# EAGLE design GameboyCartridgeKS_RevengeLite (EAGLE 9.5.2)
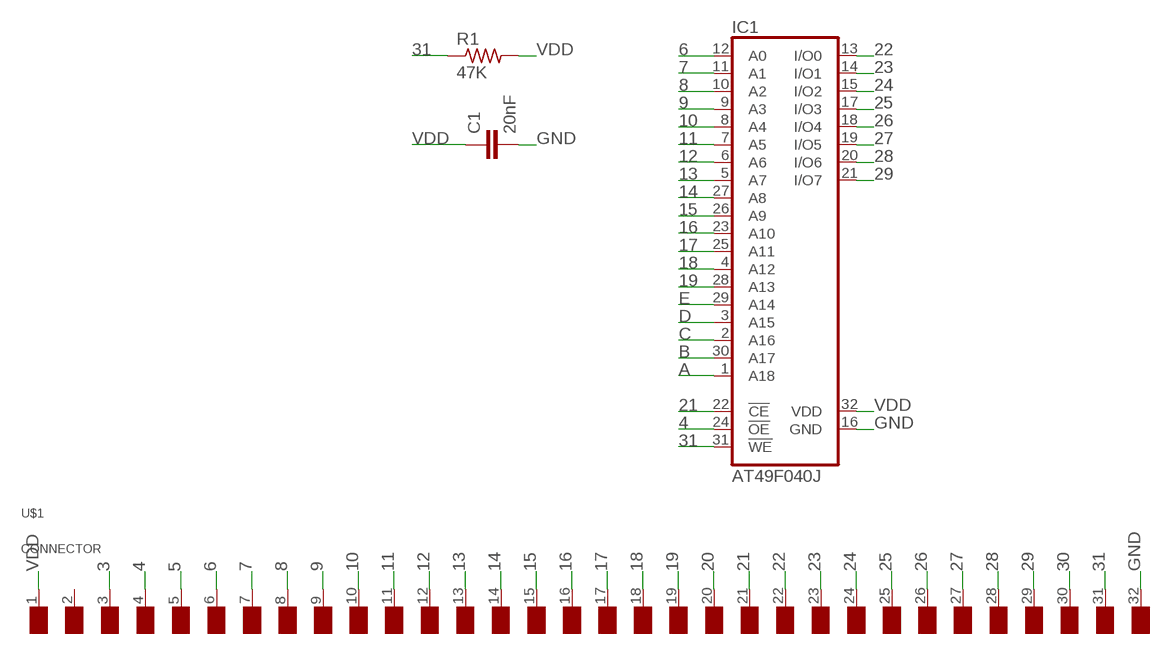
[diagram p0: schematic, sheet 1]

## Parts
C1  20nF  C-EUC0805  [C0805]
IC1  AT49F040J  [PLCC32R]
R1  47K  R-US_M0805  [M0805]
U$1  CONNECTOR  [CONNECTOR]

## Nets
3: U$1.3(/WR)
4: IC1.24(!OE) U$1.4(/RD)
5: U$1.5(/RCS)
6: IC1.12(A0) U$1.6(A0)
7: IC1.11(A1) U$1.7(A1)
8: IC1.10(A2) U$1.8(A2)
9: IC1.9(A3) U$1.9(A3)
10: IC1.8(A4) U$1.10(A4)
11: IC1.7(A5) U$1.11(A5)
12: IC1.6(A6) U$1.12(A6)
13: IC1.5(A7) U$1.13(A7)
14: IC1.27(A8) U$1.14(A8)
15: IC1.26(A9) U$1.15(A9)
16: IC1.23(A10) U$1.16(A10)
17: IC1.25(A11) U$1.17(A11)
18: IC1.4(A12) U$1.18(A12)
19: IC1.28(A13) U$1.19(A13)
20: U$1.20(A14)
21: IC1.22(!CE) U$1.21(A15)
22: IC1.13(I/O0) U$1.22(D0)
23: IC1.14(I/O1) U$1.23(D1)
24: IC1.15(I/O2) U$1.24(D2)
25: IC1.17(I/O3) U$1.25(D3)
26: IC1.18(I/O4) U$1.26(D4)
27: IC1.19(I/O5) U$1.27(D5)
28: IC1.20(I/O6) U$1.28(D6)
29: IC1.21(I/O7) U$1.29(D7)
30: U$1.30(/RS)
31: IC1.31(!WE) R1.1 U$1.31(VIN)
A: IC1.1(A18)
B: IC1.30(A17)
C: IC1.2(A16)
D: IC1.3(A15)
E: IC1.29(A14)
GND: C1.2 IC1.16(GND) U$1.32(GND)
VDD: C1.1 IC1.32(VDD) R1.2 U$1.1(VDD)
Unconnected: U$1.2(NC)

## Library data of the parts
C1 = resistor:C-EU: CAPACITOR, European symbol
IC1 = gameboy:AT49F040J: 4-Megabit FLASH MEMORY (512 K x 8 bit) 5 V-only
R1 = resistor:R-US_: RESISTOR, American symbol
U$1 = gameboy:CONNECTOR: Connector Pads for Gameboy Cartridges

## Board
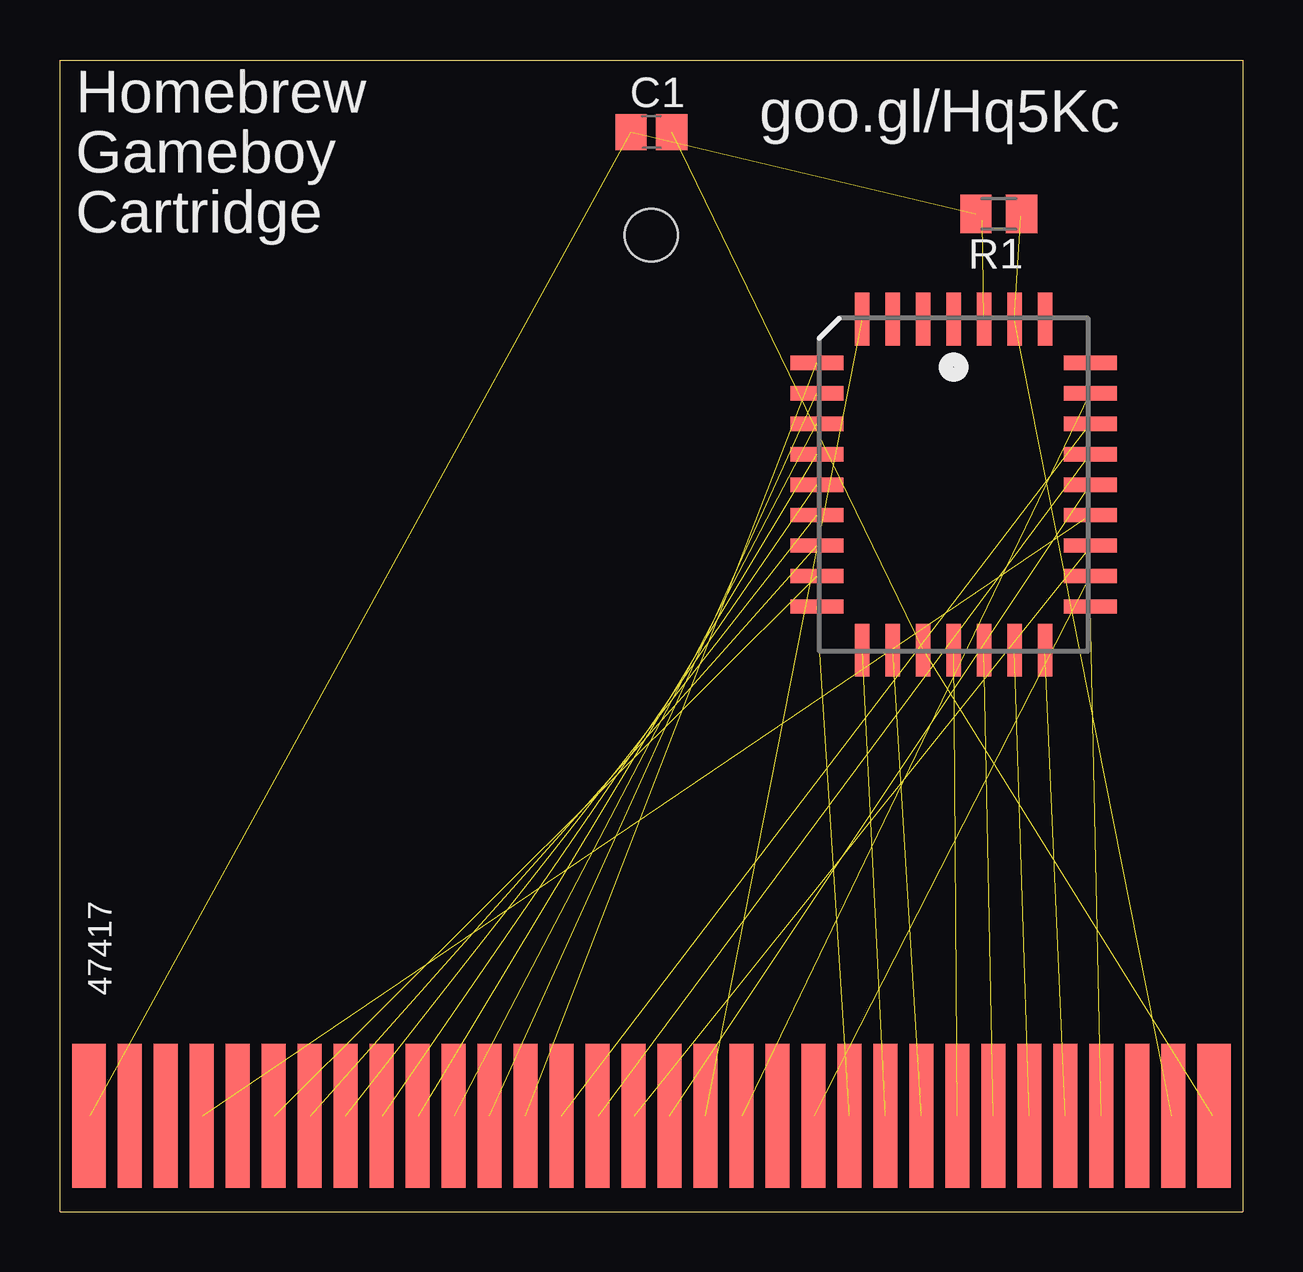
[diagram p1: board, top side]

Size 49.3 x 48 mm. Coordinates in mm from the lower left corner, seen from the top.
Outline: 49.3,48 49.3,0 0,0 0,48 49.3,48
Copper layers (1*16): Top 0.035mm / dielectric 1.5mm / Bottom 0.035mm
Design rules "default": minimum track width 6mil, minimum drill 12mil, track to track 6mil, track to pad 6mil, pad to pad 6mil, via to via 6mil, smd to smd 0mil, copper to edge 10mil, drill to drill 10mil, minimum pad ring 10mil, minimum via ring 6mil, stop-mask expansion 2mil, vias tented up to drill 100mil, thermal gap 10mil
Holes 2.2 mm at 24.65,40.7

### Footprints (pad centres in the part's own frame; a part is rotated, then mirrored left to right if it is on the bottom)
C0805 = smd 1.3 x 1.5: 1 -0.85,0; 2 0.85,0
PLCC32R = smd 0.6 x 2.2: 1 0,6.9; 2 -1.27,6.9; 3 -2.54,6.9; 4 -3.81,6.9; 14 -3.81,-6.9; 15 -2.54,-6.9; 16 -1.27,-6.9; 17 0,-6.9; 18 1.27,-6.9; 19 2.54,-6.9; 20 3.81,-6.9; 30 3.81,6.9; 31 2.54,6.9; 32 1.27,6.9 | smd 2.2 x 0.6: 5 -5.7,5.08; 6 -5.7,3.81; 7 -5.7,2.54; 8 -5.7,1.27; 9 -5.7,0; 10 -5.7,-1.27; 11 -5.7,-2.54; 12 -5.7,-3.81; 13 -5.7,-5.08; 21 5.7,-5.08; 22 5.7,-3.81; 23 5.7,-2.54; 24 5.7,-1.27; 25 5.7,0; 26 5.7,1.27; 27 5.7,2.54; 28 5.7,3.81; 29 5.7,5.08
M0805 = smd 1.3 x 1.6: 1 -0.95,0; 2 0.95,0
CONNECTOR = smd 1.4 x 6: 1 0.7,-3; 32 47.6,-3 | smd 1 x 6: 2 2.4,-3; 3 3.9,-3; 4 5.4,-3; 5 6.9,-3; 6 8.4,-3; 7 9.9,-3; 8 11.4,-3; 9 12.9,-3; 10 14.4,-3; 11 15.9,-3; 12 17.4,-3; 13 18.9,-3; 14 20.4,-3; 15 21.9,-3; 16 23.4,-3; 17 24.9,-3; 18 26.4,-3; 19 27.9,-3; 20 29.4,-3; 21 30.9,-3; 22 32.4,-3; 23 33.9,-3; 24 35.4,-3; 25 36.9,-3; 26 38.4,-3; 27 39.9,-3; 28 41.4,-3; 29 42.9,-3; 30 44.4,-3; 31 45.9,-3

### Placement (x,y rotation side)
C1  24.65,45 0 top
IC1  37.25,30.3 0 top
R1  39.13,41.58 180 top
U$1  0.5,7 0 top

### Tracks (layer width: path | path; a pad name or v marks a point on that pad's centre or on a via)
3
  Top 0.152: 4.45,4 U$1.3
4  (1 unrouted)
  Top 0.152: 5.95,4 U$1.4
5
  Top 0.152: 7.45,4 U$1.5
6  (1 unrouted)
  Top 0.152: 8.95,4 U$1.6
7  (1 unrouted)
  Top 0.152: 10.45,4 U$1.7
8  (1 unrouted)
  Top 0.152: 11.85,4 U$1.8
9  (1 unrouted)
  Top 0.152: 13.45,4 U$1.9
10  (1 unrouted)
  Top 0.152: 14.95,4 U$1.10
11  (1 unrouted)
  Top 0.152: 16.45,4 U$1.11
12  (1 unrouted)
  Top 0.152: 17.85,4 U$1.12
13  (1 unrouted)
  Top 0.152: 19.35,4 U$1.13
14  (1 unrouted)
  Top 0.152: 42.95,32.9 IC1.27 | 20.85,4 U$1.14
15  (1 unrouted)
  Top 0.152: 22.45,4 U$1.15
16  (1 unrouted)
  Top 0.152: 42.95,27.7 IC1.23 | 23.95,4 U$1.16
17  (1 unrouted)
  Top 0.152: 25.35,4 U$1.17
18  (1 unrouted)
  Top 0.152: 26.85,4 U$1.18
19  (1 unrouted)
  Top 0.152: 42.95,34.2 IC1.28 | 28.45,4 U$1.19
20
  Top 0.152: 29.95,4 U$1.20
21  (1 unrouted)
  Top 0.152: 31.35,4 U$1.21 31.45,4
22  (1 unrouted)
  Top 0.152: 32.85,4 U$1.22
23  (1 unrouted)
  Top 0.152: 34.35,4 U$1.23
24  (1 unrouted)
  Top 0.152: 35.85,4 U$1.24 | 34.75,23.4 IC1.15
25  (1 unrouted)
  Top 0.152: 37.35,4 U$1.25
26  (1 unrouted)
  Top 0.152: 38.85,4 U$1.26 | 38.55,23.4 IC1.18
27  (1 unrouted)
  Top 0.152: 40.35,4 U$1.27
28  (1 unrouted)
  Top 0.152: 41.85,4 U$1.28
29  (1 unrouted)
  Top 0.152: 43.35,4 U$1.29
30
  Top 0.152: 44.85,4 U$1.30
31  (2 unrouted)
  Top 0.152: 40.05,41.5 R1.1 | 46.35,4 U$1.31
B
  Top 0.152: IC1.30
C
  Top 0.152: 35.95,37.2 IC1.2
D
  Top 0.152: 34.65,37.2 IC1.3
E
  Top 0.152: 42.95,35.4 IC1.29
GND  (2 unrouted)
  Top 0.152: 25.45,45 C1.2 | 48.05,4 U$1.32
VDD  (3 unrouted)
  Top 0.152: 23.85,45 C1.1 | 38.15,41.6 R1.2 38.25,41.5 38.45,41.3 | 38.45,37.2 IC1.32 | 1.25,4 U$1.1

### Text on the board
tPlace: Homebrew | goo.gl/Hq5Kc | Gameboy | Cartridge | 47417